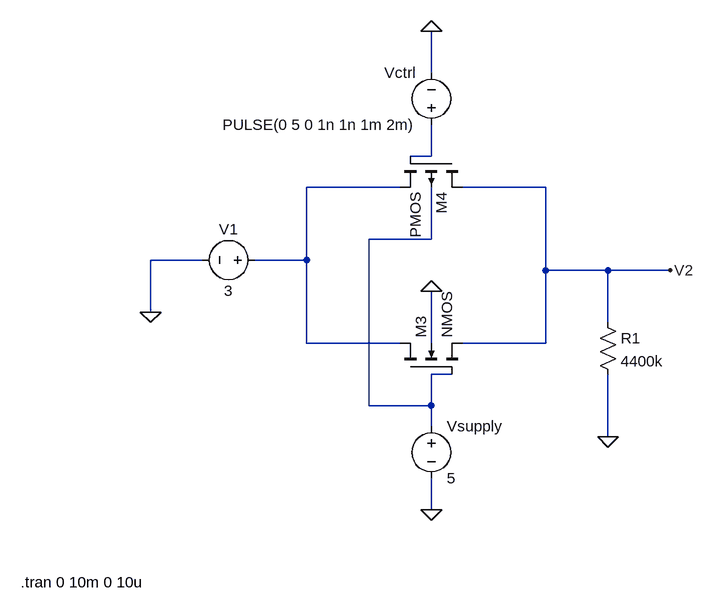
[diagram p0: schematic Switch 1.asc]
Switch 1.asc, the LTspice schematic file:
Version 4.1
SHEET 1 928 680
WIRE 448 -640 448 -704
WIRE 448 -512 448 -560
WIRE 448 -512 416 -512
WIRE 400 -464 256 -464
WIRE 624 -464 496 -464
WIRE 448 -384 448 -464
WIRE 448 -384 352 -384
WIRE 96 -352 16 -352
WIRE 256 -352 256 -464
WIRE 256 -352 176 -352
WIRE 624 -336 624 -464
WIRE 720 -336 624 -336
WIRE 816 -336 720 -336
WIRE 16 -272 16 -352
WIRE 720 -256 720 -336
WIRE 256 -224 256 -352
WIRE 400 -224 256 -224
WIRE 448 -224 448 -304
WIRE 624 -224 624 -336
WIRE 624 -224 496 -224
WIRE 480 -176 448 -176
WIRE 352 -128 352 -384
WIRE 448 -128 448 -176
WIRE 448 -128 352 -128
WIRE 448 -96 448 -128
WIRE 720 -80 720 -176
WIRE 448 32 448 -16
FLAG 16 -272 0
FLAG 720 -80 0
FLAG 816 -336 V2
FLAG 448 32 0
FLAG 448 -704 0
FLAG 448 -304 0
SYMBOL voltage 192 -352 R90
WINDOW 0 -32 56 VBottom 2
WINDOW 3 32 56 VTop 2
WINDOW 123 0 0 Left 0
WINDOW 39 0 0 Left 0
SYMATTR InstName V1
SYMATTR Value 3
SYMBOL res 704 -272 R0
SYMATTR InstName R1
SYMATTR Value 4400k
SYMBOL voltage 448 -112 R0
SYMATTR InstName Vsupply
SYMATTR Value 5
SYMBOL voltage 448 -544 R180
WINDOW 0 24 96 Left 2
WINDOW 3 24 16 Left 2
WINDOW 123 0 0 Left 0
WINDOW 39 0 0 Left 0
SYMATTR InstName Vctrl
SYMATTR Value PULSE(0 5 0 1n 1n 1m 2m)
SYMBOL nmos4 400 -176 R270
SYMATTR InstName M3
SYMBOL pmos4 496 -512 R90
SYMATTR InstName M4
TEXT -184 144 Left 2 !.tran 0 10m 0 10u

The netlist it stands for:
* Switch 1.asc
V1 N002 0 3
R1 V2 0 4400k
Vsupply N003 0 5
Vctrl N001 0 PULSE(0 5 0 1n 1n 1m 2m)
M3 N002 N003 V2 0 NMOS
M4 V2 N001 N002 N003 PMOS
.model NMOS NMOS
.model PMOS PMOS
.lib standard.mos
.tran 0 10m 0 10u
.backanno
.end